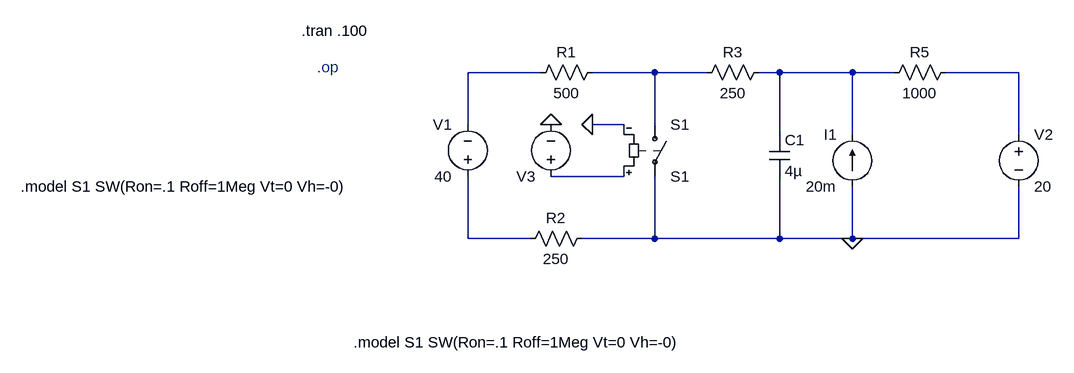
[diagram p0: schematic pas62.asc]
pas62.asc, the LTspice schematic file:
Version 4.1
SHEET 1 1676 680
WIRE 80 16 -32 16
WIRE 256 16 160 16
WIRE 336 16 256 16
WIRE 448 16 416 16
WIRE 560 16 448 16
WIRE 624 16 560 16
WIRE 816 16 704 16
WIRE -32 96 -32 16
WIRE 208 96 160 96
WIRE 256 96 256 16
WIRE 208 112 208 96
WIRE 448 112 448 16
WIRE 560 112 560 16
WIRE 816 112 816 16
WIRE 208 176 208 160
WIRE 208 176 96 176
WIRE -32 272 -32 176
WIRE 64 272 -32 272
WIRE 256 272 256 176
WIRE 256 272 144 272
WIRE 448 272 448 176
WIRE 448 272 256 272
WIRE 560 272 560 192
WIRE 560 272 448 272
WIRE 816 272 816 192
WIRE 816 272 560 272
FLAG 560 272 0
FLAG 160 96 0
FLAG 96 96 0
SYMBOL voltage -32 192 R180
WINDOW 0 24 96 Left 2
WINDOW 3 24 16 Left 2
WINDOW 123 0 0 Left 0
WINDOW 39 0 0 Left 0
SYMATTR InstName V1
SYMATTR Value 40
SYMBOL voltage 816 96 R0
WINDOW 123 0 0 Left 0
WINDOW 39 0 0 Left 0
SYMATTR InstName V2
SYMATTR Value 20
SYMBOL res 176 0 R90
WINDOW 0 0 56 VBottom 2
WINDOW 3 32 56 VTop 2
SYMATTR InstName R1
SYMATTR Value 500
SYMBOL res 160 256 R90
WINDOW 0 0 56 VBottom 2
WINDOW 3 32 56 VTop 2
SYMATTR InstName R2
SYMATTR Value 250
SYMBOL res 432 0 R90
WINDOW 0 0 56 VBottom 2
WINDOW 3 32 56 VTop 2
SYMATTR InstName R3
SYMATTR Value 250
SYMBOL res 720 0 R90
WINDOW 0 0 56 VBottom 2
WINDOW 3 32 56 VTop 2
SYMATTR InstName R5
SYMATTR Value 1000
SYMBOL current 560 192 R180
WINDOW 0 24 80 Left 2
WINDOW 3 24 0 Left 2
WINDOW 123 0 0 Left 0
WINDOW 39 0 0 Left 0
SYMATTR InstName I1
SYMATTR Value 20m
SYMBOL sw 256 80 R0
SYMATTR InstName S1
SYMATTR Value S1
SYMBOL cap 432 112 R0
SYMATTR InstName C1
SYMATTR Value 4µ
SYMBOL voltage 96 192 R180
WINDOW 3 24 96 Invisible 2
WINDOW 123 0 0 Left 0
WINDOW 39 0 0 Left 0
SYMATTR InstName V3
SYMATTR Value PULSE(0 1 50m 1u 1u 250m 250m)
TEXT -288 -48 Left 2 !.tran .100
TEXT -720 192 Left 2 !.model S1 SW(Ron=.1 Roff=1Meg Vt=0 Vh=-0)
TEXT -264 8 Left 2 ;.op
TEXT -208 432 Left 2 !.model S1 SW(Ron=.1 Roff=1Meg Vt=0 Vh=-0)

The netlist it stands for:
* pas62.asc
V1 N006 N001 40
V2 N004 0 20
R1 N002 N001 500
R2 0 N006 250
R3 N003 N002 250
R5 N004 N003 1000
I1 0 N003 20m
S1 N002 0 N005 0 S1
C1 N003 0 4µ
V3 N005 0 PULSE(0 1 50m 1u 1u 250m 250m)
.tran .100
.model S1 SW(Ron=.1 Roff=1Meg Vt=0 Vh=-0)
* .op
.model S1 SW(Ron=.1 Roff=1Meg Vt=0 Vh=-0)
.backanno
.end